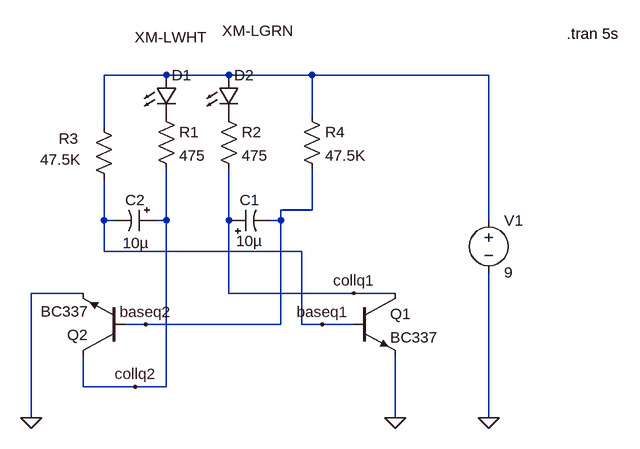
[diagram p0: schematic blinker.asc]
blinker.asc, the LTspice schematic file:
Version 4
SHEET 1 880 680
WIRE -320 -272 -416 -272
WIRE -224 -272 -320 -272
WIRE -96 -272 -224 -272
WIRE 176 -272 -96 -272
WIRE -96 -208 -96 -272
WIRE -416 -192 -416 -272
WIRE -96 -64 -96 -128
WIRE -96 -64 -144 -64
WIRE -416 -48 -416 -112
WIRE -400 -48 -416 -48
WIRE -320 -48 -320 -128
WIRE -320 -48 -336 -48
WIRE -224 -48 -224 -128
WIRE -144 -48 -144 -64
WIRE -144 -48 -160 -48
WIRE 176 -48 176 -272
WIRE -416 0 -416 -48
WIRE -112 0 -416 0
WIRE -448 64 -528 64
WIRE -224 64 -224 -48
WIRE -32 64 -224 64
WIRE 32 64 -32 64
WIRE -352 112 -384 112
WIRE -144 112 -144 -48
WIRE -144 112 -352 112
WIRE -112 112 -112 0
WIRE -80 112 -112 112
WIRE -32 112 -80 112
WIRE -448 208 -448 160
WIRE -368 208 -448 208
WIRE -320 208 -320 -48
WIRE -320 208 -368 208
WIRE -528 256 -528 64
WIRE 32 256 32 160
WIRE 176 256 176 32
FLAG 32 256 0
FLAG -528 256 0
FLAG 176 256 0
FLAG -352 112 baseq2
FLAG -80 112 baseq1
FLAG -368 208 collq2
FLAG -32 64 collq1
SYMBOL npn -32 64 R0
SYMATTR InstName Q1
SYMATTR Value BC337
SYMBOL npn -384 160 R180
SYMATTR InstName Q2
SYMATTR Value BC337
SYMBOL LED -336 -272 R0
WINDOW 3 -33 -58 Left 2
SYMATTR Value XM-LWHT
SYMATTR InstName D1
SYMBOL LED -240 -272 R0
WINDOW 3 6 -68 Left 2
SYMATTR Value XM-LGRN
SYMATTR InstName D2
SYMBOL res -336 -224 R0
SYMATTR InstName R1
SYMATTR Value 475
SYMATTR SpiceLine tol=1 pwr=0.1
SYMBOL res -240 -224 R0
SYMATTR InstName R2
SYMATTR Value 475
SYMATTR SpiceLine tol=1 pwr=0.1
SYMBOL res -432 -208 R0
WINDOW 0 -54 34 Left 2
WINDOW 3 -82 66 Left 2
SYMATTR InstName R3
SYMATTR Value 47.5K
SYMATTR SpiceLine tol=1 pwr=0.1
SYMBOL res -112 -224 R0
SYMATTR InstName R4
SYMATTR Value 47.5K
SYMATTR SpiceLine tol=1 pwr=0.1
SYMBOL voltage 176 -64 R0
WINDOW 123 0 0 Left 0
WINDOW 39 24 36 Left 2
SYMATTR InstName V1
SYMATTR Value 9
SYMBOL polcap -224 -32 R270
WINDOW 0 32 32 VTop 2
WINDOW 3 0 32 VBottom 2
SYMATTR InstName C1
SYMATTR Value 10µ
SYMATTR Description Capacitor
SYMATTR Type cap
SYMATTR SpiceLine V=16 Irms=2.12132 Rser=0.06 Lser=0 mfg="KEMET" pn="A700V106M016ATE060" type="Al electrolytic"
SYMBOL polcap -336 -64 R90
WINDOW 0 0 32 VBottom 2
WINDOW 3 35 31 VTop 2
SYMATTR InstName C2
SYMATTR Value 10µ
SYMATTR Description Capacitor
SYMATTR Type cap
SYMATTR SpiceLine V=12.5 Irms=2.21565 Rser=0.055 Lser=0 mfg="KEMET" pn="A700V106M12RATE055" type="Al electrolytic"
TEXT 296 -336 Left 2 !.tran 5s

The netlist it stands for:
* blinker.asc
Q1 collq1 baseq1 0 0 BC337
Q2 collq2 baseq2 0 0 BC337
D1 N001 P001 XM-LWHT
D2 N001 P002 XM-LGRN
R1 P001 collq2 475 tol=1 pwr=0.1
R2 P002 collq1 475 tol=1 pwr=0.1
R3 N001 baseq1 47.5K tol=1 pwr=0.1
R4 N001 baseq2 47.5K tol=1 pwr=0.1
V1 N001 0 9
C1 collq1 baseq2 10µ V=16 Irms=2.12132 Rser=0.06 Lser=0 mfg="KEMET" pn="A700V106M016ATE060" type="Al electrolytic"
C2 collq2 baseq1 10µ V=12.5 Irms=2.21565 Rser=0.055 Lser=0 mfg="KEMET" pn="A700V106M12RATE055" type="Al electrolytic"
.model D D
.lib standard.dio
.model NPN NPN
.model PNP PNP
.lib standard.bjt
.tran 5s
.backanno
.end